# EAGLE schematic tetris_mega_3 (EAGLE 6.2)
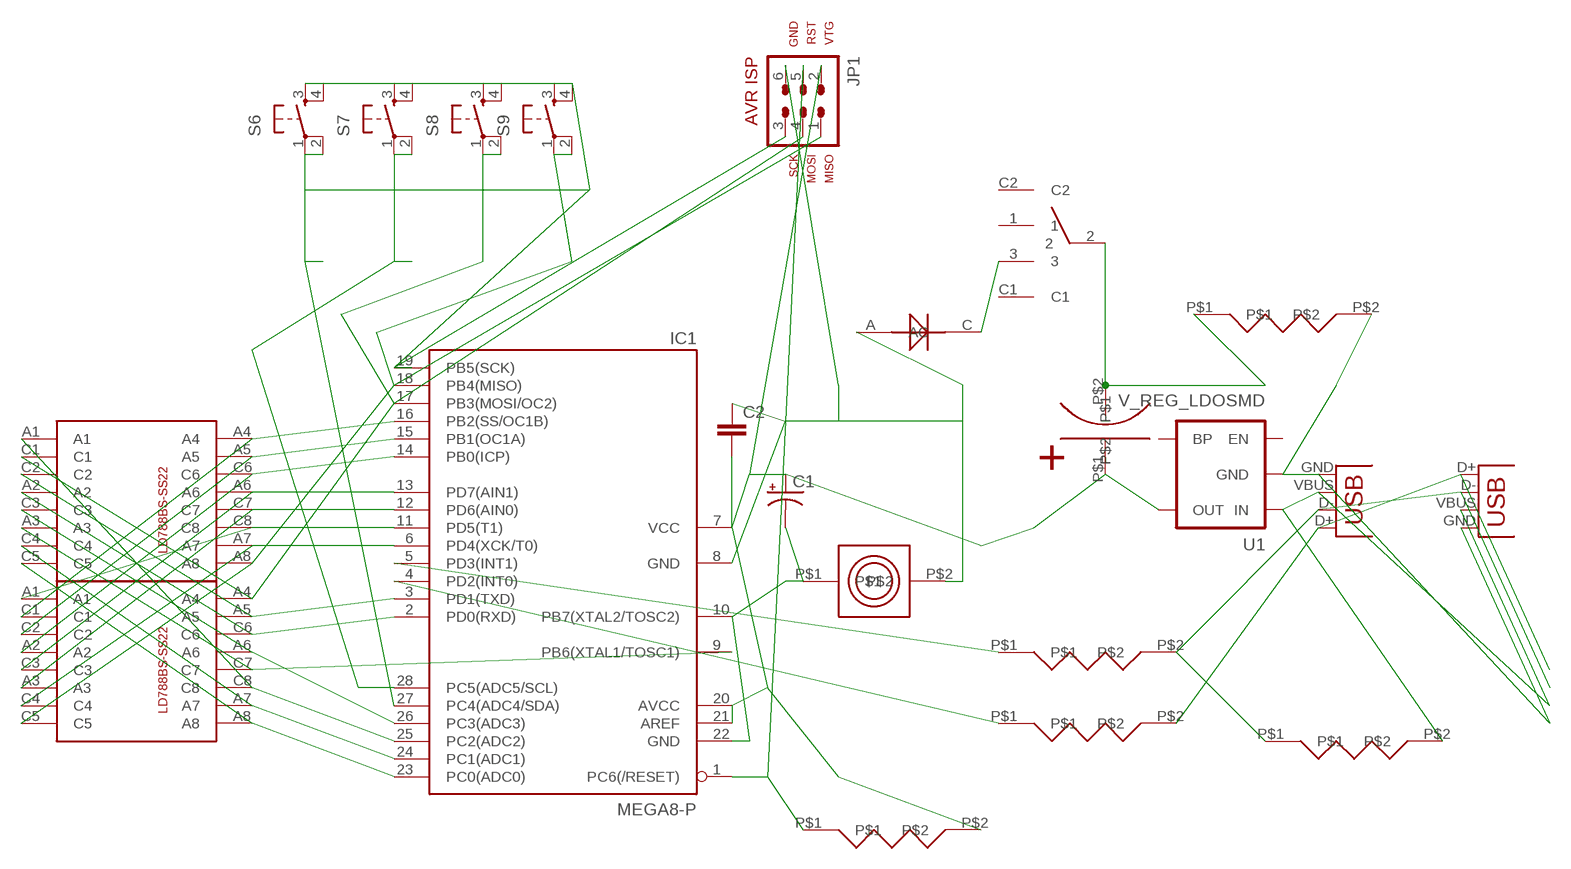
[diagram p0: schematic, sheet 1]

## Parts
C1  CAP_POLPTH2  [CPOL-RADIAL-10UF-25V]
C2  CAPPTH  [CAP-PTH-SMALL]
IC1  MEGA8-P  [DIL28-3]
JP1  AVR-ISP-6R  [AVR-ISP-6R]
S6  TAC_SWITCHPTH  [TACTILE-PTH]
S7  TAC_SWITCHPTH  [TACTILE-PTH]
S8  TAC_SWITCHPTH  [TACTILE-PTH]
S9  TAC_SWITCHPTH  [TACTILE-PTH]
U1  V_REG_LDOSMD  [SOT23-5]
U$1  LD788BS-SS22  [LD788BS-SS22]
U$2  LD788BS-SS22  [LD788BS-SS22]
U$3  D-6  [D-7.5]
U$4  I-80450RF  [ISK4.1K_I-80450RF_I2G]
U$5  NICHICON_12F  [NICHICON_10X30]
U$6  R-6  [R-6]
U$7  R-6  [R-6]
U$8  SWITCH  [SWITCH]
U$9  R-6  [R-6]
U$10  R-6  [R-6]
U$11  R-6  [R-6]
X1  USB-MICROB  [USB-MICROB]
X3  USBOLD  [USB-MINIB-OLD]

## Nets
N$1: IC1.17(PB3(MOSI/OC2)) JP1.4 S8.1 S8.2 U$1.A4 U$2.C1
N$2: IC1.3(PD1(TXD)) U$1.A5 U$2.C2
N$3: IC1.2(PD0(RXD)) U$1.C6 U$2.A2
N$4: IC1.26(PC3(ADC3)) U$1.A6 U$2.C3
N$5: IC1.9(PB6(XTAL1/TOSC1)) U$1.C7 U$2.A3
N$6: IC1.24(PC1(ADC1)) U$1.A7 U$2.C4
N$7: IC1.23(PC0(ADC0)) U$1.A8 U$2.C5
N$8: IC1.25(PC2(ADC2)) U$1.C8 U$2.A1
N$9: U$5.P$2 U$6.P$1 U$8.2
N$10: IC1.15(PB1(OC1A)) U$1.C2 U$2.A5
N$11: IC1.14(PB0(ICP)) U$1.A2 U$2.C6
N$12: IC1.13(PD7(AIN1)) U$1.C3 U$2.A6
N$13: IC1.12(PD6(AIN0)) U$1.A3 U$2.C7
N$14: IC1.11(PD5(T1)) U$1.A1 U$2.C8
N$15: IC1.6(PD4(XCK/T0)) U$1.C4 U$2.A7
N$16: IC1.18(PB4(MISO)) JP1.1 S9.1 S9.2 U$1.C5 U$2.A8
N$17: C1.2(-) IC1.10(PB7(XTAL2/TOSC2)) IC1.22(GND) U$4.P$1
N$18: IC1.19(PB5(SCK)) JP1.3 S6.3 S6.4 S7.3 S7.4 S8.3 S8.4 S9.3 S9.4
N$19: IC1.5(PD3(INT1)) U$10.P$1
N$20: IC1.27(PC4(ADC4/SDA)) S6.1 S6.2
N$21: U$3.C U$8.3
N$22: IC1.8(GND) JP1.6 U$3.A U$4.P$2
N$23: U1.1(IN) U$11.P$2 X1.VBUS X3.VBUS
N$24: U1.2(GND) U$6.P$2 X1.GND X3.GND
N$25: U$10.P$2 U$11.P$1 X1.D- X3.D-
N$26: C1.1(+) C2.2 IC1.7(VCC) IC1.20(AVCC) IC1.21(AREF) JP1.2 U1.5(OUT) U$5.P$1 U$7.P$2
N$27: IC1.4(PD2(INT0)) U$9.P$1
N$28: IC1.16(PB2(SS/OC1B)) U$1.C1 U$2.A4
N$29: C2.1 IC1.1(PC6(/RESET)) JP1.5 U$7.P$1
N$30: U$9.P$2 X1.D+ X3.D+
N$31: IC1.28(PC5(ADC5/SCL)) S7.1 S7.2
Unconnected: U1.3(EN) U1.4(BP) U$8.1 U$8.C1 U$8.C2

## Library data of the parts
C1 = SparkFun:CAP_POL: Capacitor Polarized These are standard SMD and PTH capacitors. Normally 10uF, 47uF, and 100uF in electrolytic and tantalum varieties. Always verify the external diameter of the through hole cap, it varies with capacity, voltage, and manufacturer. The EIA devices should be standard.
C2 = SparkFun:CAP: Capacitor Standard 0603 ceramic capacitor, and 0.1" leaded capacitor.
IC1 = atmel:MEGA8-P: MICROCONTROLLER 8 Kbytes FLASH, 1 kbytes SRAM, 512 bytes EEPROM, USART, 4-channel 10 bit ADC, 2-channel 8 bit ADC Pin compatible with Atmega48, ATMega88, ATMega168 Source: avr.lbr; OC_FARNELL: unknown; OC_NEWARK: unknown
JP1 = avr-5-4.16:AVR-ISP-6: AVR ISP-6 Serial Programming Header
S6-S9 = SparkFun:TAC_SWITCH: Momentary Switch Button commonly used for reset or general input. Spark Fun Electronics SKU : COM-00097
U1 = SparkFun:V_REG_LDO: Voltage Regulator LDO Standard 150mA LDO voltage regulator in SOT-23 layout. Micrel part MIC5205. BP (by-pass) pin is used to lower output noise with 470pF cap.
U$1 U$2 = mrule:LD788BS-SS22
U$3 = mrule:D-6
U$4 = mrule:I-80450RF
U$5 = mrule:NICHICON_12F
U$6 U$7 U$9-U$11 = mrule:R-6
U$8 = mrule:SWITCH
X1 X3 = SparkFun:USB: USB Connectors USB-B-PTH is fully proven SKU : PRT-00139 USB-miniB is fully proven SKU : PRT-00587 USB-A-PCB is untested. USB-A-H is throughly reviewed, but untested. Spark Fun Electronics SKU : PRT-00437 USB-B-SMT is throughly reviewed, but untested. Needs silkscreen touching up. USB-A-S has not been used/tested USB-MB-H has not been used/tested